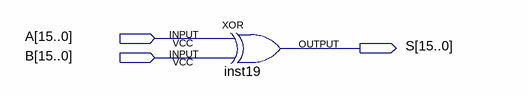
[diagram p0: schematic sheet]
// Quartus schematic XORR.bdf as structural Verilog: 1 symbols, 3 pins
module XORR (
  input  [15:0] A,
  input  [15:0] B,
  output [15:0] S
);

  assign S = A ^ B;  // XOR inst19, 16 bits wide
endmodule
